# Altium project PCB_Project.PrjPcb
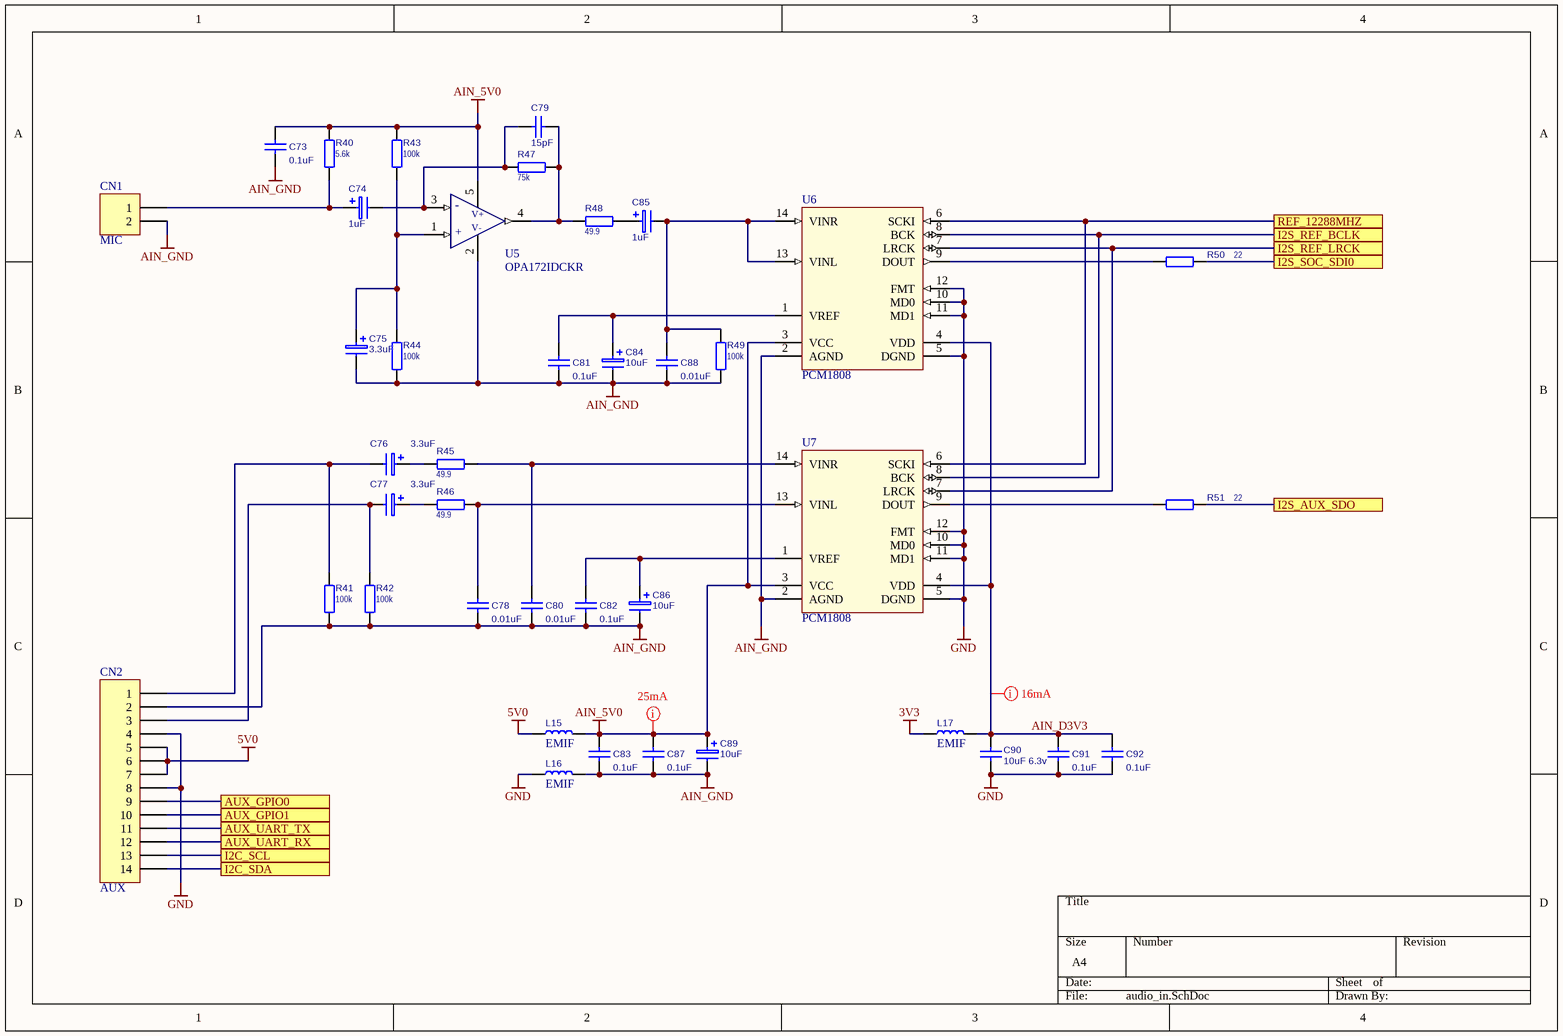
[diagram p0: audio_in.SchDoc]
5 sheets, 229 parts. Net scope: global (net labels, ports and power ports of the same name join across sheets).
Board file: PCB.PcbDoc
Sheets:
  audio_in.SchDoc
  audio_dsp.SchDoc
  audio_amp_hf.SchDoc
  audio_amp.SchDoc
  mcu.SchDoc

## Sheet audio_in.SchDoc
size A4

### Parts
C73  value 0.1uF  [C0603]  (hidden comment: CC0603KRX7R9BB104)
C74  1uF  [ALUM_4]
C75  3.3uF  [ALUM_3.3]
C76  value 3.3uF  [ALUM_3.3]  (hidden comment: UWT1V3R3MCL2B)
C77  value 3.3uF  [ALUM_3.3]  (hidden comment: UWT1V3R3MCL2B)
C78  value 0.01uF  [C0603]  (hidden comment: CL10B103KB8NNNC)
C79  value 15pF  [C0603]  (hidden comment: CC0603GRNPO9BN150)
C80  value 0.01uF  [C0603]  (hidden comment: CL10B103KB8NNNC)
C81  value 0.1uF  [C0603]  (hidden comment: CC0603KRX7R9BB104)
C82  value 0.1uF  [C0603]  (hidden comment: CC0603KRX7R9BB104)
C83  value 0.1uF  [C0603]  (hidden comment: CC0603KRX7R9BB104)
C84  value 10uF  [ALUM_4]  (hidden comment: CB016M0010RSB-0405)
C85  1uF  [ALUM_4]
C86  value 10uF  [ALUM_4]  (hidden comment: CB016M0010RSB-0405)
C87  value 0.1uF  [C0603]  (hidden comment: CC0603KRX7R9BB104)
C88  value 0.01uF  [C0603]  (hidden comment: CL10B103KB8NNNC)
C89  value 10uF  [ALUM_3.3]  (hidden comment: CB016M0010RSB-0405)
C90  value 10uF 6.3v  [C0603]  (hidden comment: CC0603MRX5R5BB106)
C91  value 0.1uF  [C0603]  (hidden comment: CC0603KRX7R9BB104)
C92  value 0.1uF  [C0603]  (hidden comment: CC0603KRX7R9BB104)
CN1  MIC  [DG308-2.54-2P]
CN2  AUX  [PLS-14R]
L15  value EMIF  [IND0603]  (hidden comment: BLM18AG102SN1D)
L16  value EMIF  [IND0603]  (hidden comment: BLM18AG102SN1D)
L17  value EMIF  [IND0603]  (hidden comment: BLM18AG102SN1D)
R40  5.6k  [R0603]
R41  100k  [R0603]
R42  100k  [R0603]
R43  100k  [R0603]
R44  100k  [R0603]
R45  49.9  [R0603]
R46  49.9  [R0603]
R47  75k  [R0603]
R48  49.9  [R0603]
R49  100k  [R0603]
R50  22  [R0603]
R51  22  [R0603]
U5  OPA172IDCKR  [SC70-5]
U6  PCM1808  [TSSOP-14]
U7  PCM1808  [TSSOP-14]

### Ports
AUX_GPIO0, AUX_GPIO1, AUX_UART_RX, AUX_UART_TX, I2C_SCL, I2C_SDA, I2S_AUX_SDO, I2S_REF_BCLK, I2S_REF_LRCK, I2S_SOC_SDI0, REF_12288MHZ

### Nets
3V3: L17.2
5V0: CN2.5 CN2.6 CN2.7 L15.2
AIN_5V0: C73.1 C83.1 C87.1 C89.1(+) L15.1 R40.1 R43.1 U5.5(V+) U6.3(VCC) U7.3(VCC)
AIN_GND: C73.2 C75.2(-) C78.2 C80.2 C81.2 C82.2 C83.2 C84.2(-) C86.2(-) C87.2 C88.2 C89.2(-) CN1.2 CN2.2 L16.1 R41.2 R42.2 R44.2 R49.2 U5.2(V-) U6.2(AGND) U7.2(AGND)
GND: C90.1 C91.2 C92.2 CN2.4 CN2.8 L16.2 U6.5(DGND) U6.10(MD0) U6.11(MD1) U6.12(FMT) U7.5(DGND) U7.10(MD0) U7.11(MD1) U7.12(FMT)
AIN_D3V3: C90.2 C91.1 C92.1 L17.1 U6.4(VDD) U7.4(VDD)
AUX_GPIO0: CN2.9 ; port AUX_GPIO0
AUX_GPIO1: CN2.10 ; port AUX_GPIO1
AUX_UART_RX: CN2.12 ; port AUX_UART_RX
AUX_UART_TX: CN2.11 ; port AUX_UART_TX
I2C_SCL: CN2.13 ; port I2C_SCL
I2C_SDA: CN2.14 ; port I2C_SDA
I2S_AUX_SDO: R51.2 ; port I2S_AUX_SDO
I2S_REF_BCLK: U6.8(BCK) U7.8(BCK) ; port I2S_REF_BCLK
I2S_REF_LRCK: U6.7(LRCK) U7.7(LRCK) ; port I2S_REF_LRCK
I2S_SOC_SDI0: R50.2 ; port I2S_SOC_SDI0
REF_12288MHZ: U6.6(SCKI) U7.6(SCKI) ; port REF_12288MHZ
NetC74_1: C74.1(+) CN1.1 R40.2
NetC74_2: C74.2(-) C79.1 R47.2 U5.3(-)
NetC75_1: C75.1(+) R43.2 R44.1 U5.1(+)
NetC76_1: C76.1(+) R45.1
NetC76_2: C76.2(-) CN2.1 R41.1
NetC77_1: C77.1(+) R46.1
NetC77_2: C77.2(-) CN2.3 R42.1
NetC78_1: C78.1 R46.2 U7.13(VINL)
NetC79_2: C79.2 R47.1 R48.1 U5.4
NetC80_1: C80.1 R45.2 U7.14(VINR)
NetC81_1: C81.1 C84.1(+) U6.1(VREF)
NetC82_1: C82.1 C86.1(+) U7.1(VREF)
NetC85_1: C85.1(+) R48.2
NetC85_2: C85.2(-) C88.1 R49.1 U6.13(VINL) U6.14(VINR)
NetR50_1: R50.1 U6.9(DOUT)
NetR51_1: R51.1 U7.9(DOUT)

### Layout directives
mark named 16mA: AIN_D3V3
mark named 25mA: AIN_5V0

### Library data of the parts
C73 C78-C83 C87 C88 C90-C92 = CAP_NPOL
C74-C77 C84-C86 C89 = CAP_POL
  C74 C85: Value: 1uF
  C75: Value: 3.3uF
CN1 = HDR 2: Header, 2-Pin; LatestRevisionDate: 17-Jul-2002; LatestRevisionNote: Re-released for DXP Platform.; Publisher: Altium Limited
CN2 = HDR 14: Header, 14-Pin; LatestRevisionDate: 17-Jul-2002; LatestRevisionNote: Re-released for DXP Platform.; Publisher: Altium Limited
L15-L17 = IND_WO_IRON
R40-R51 = RESISTOR: RES
  R40: Value: 5.6k
  R41-R44 R49: Value: 100k
  R45 R46 R48: Value: 49.9
  R47: Value: 75k
  R50 R51: Value: 22
U5 = OPA172IDCKR: OPAx172 36-V, Single-Supply, 10-MHz, Rail-to-Rail Output Operational Amplifiers; value: OPA172IDCKR
U6 U7 = PCM1808: PCM1808 Single-Ended, Analog-Input 24-Bit, 96-kHz Stereo ADC; value: PCM1808

## Sheet audio_dsp.SchDoc
size A4
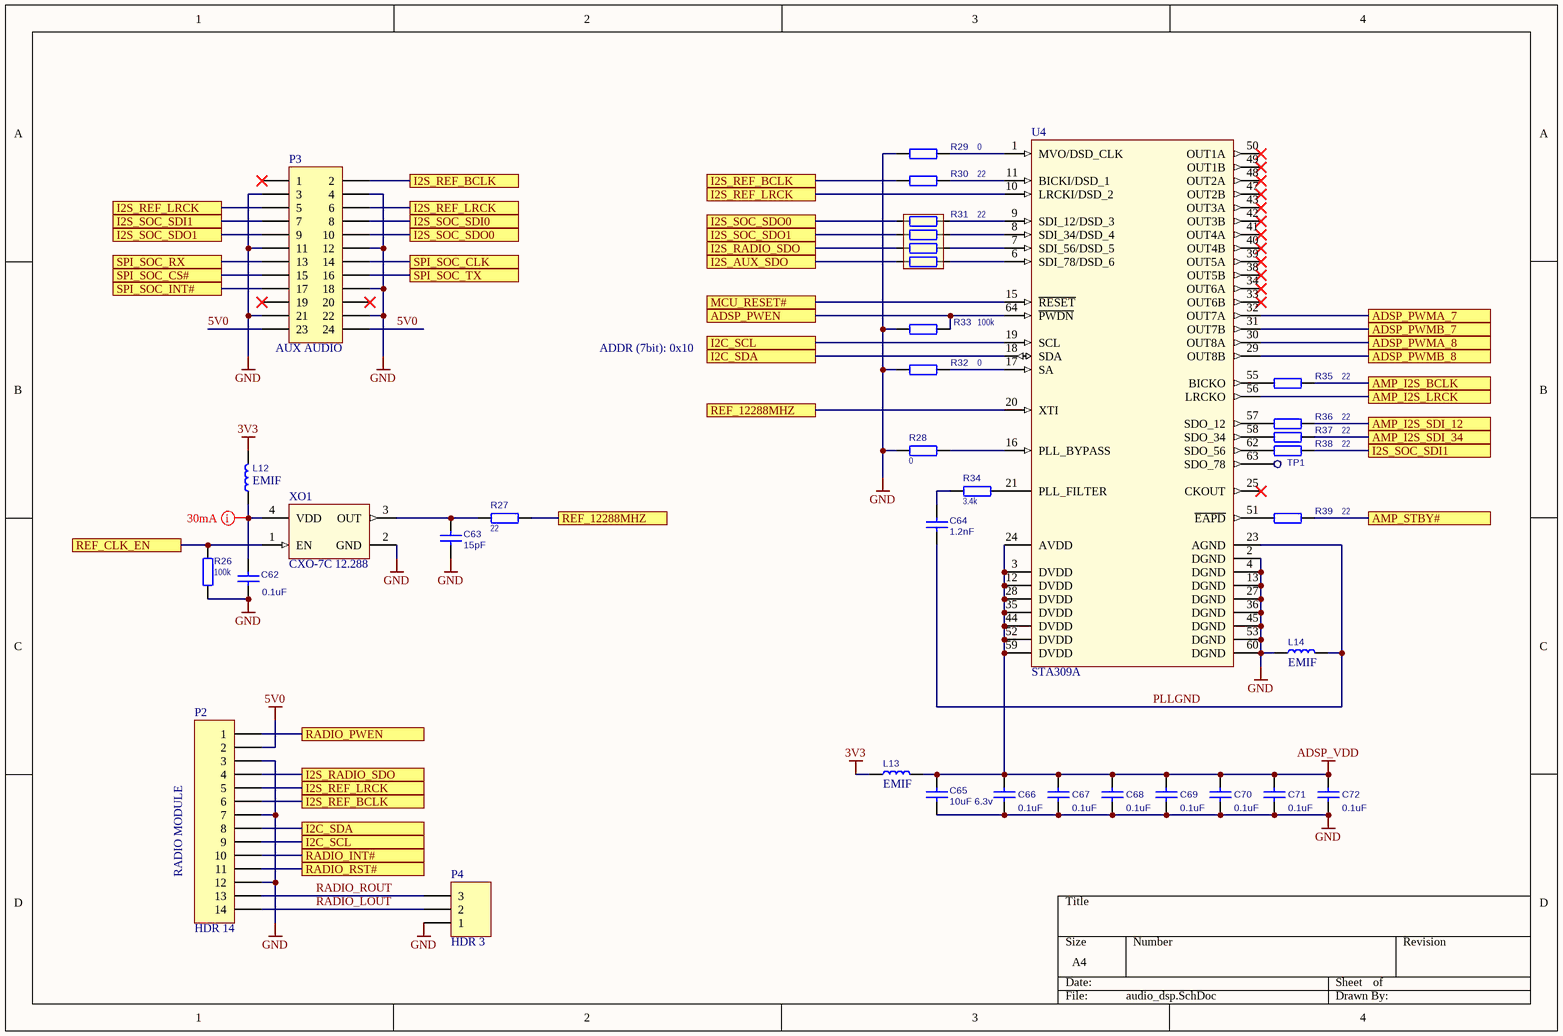
[diagram p1: audio_dsp.SchDoc]

### Parts
C62  value 0.1uF  [C0603]  (hidden comment: CC0603KRX7R9BB104)
C63  value 15pF  [C0603]  (hidden comment: CC0603GRNPO9BN150)
C64  value 1.2nF  [C0603]  (hidden comment: GRM1885C1H122JA01D)
C65  value 10uF 6.3v  [C0603]  (hidden comment: CC0603MRX5R5BB106)
C66  value 0.1uF  [C0603]  (hidden comment: CC0603KRX7R9BB104)
C67  value 0.1uF  [C0603]  (hidden comment: CC0603KRX7R9BB104)
C68  value 0.1uF  [C0603]  (hidden comment: CC0603KRX7R9BB104)
C69  value 0.1uF  [C0603]  (hidden comment: CC0603KRX7R9BB104)
C70  value 0.1uF  [C0603]  (hidden comment: CC0603KRX7R9BB104)
C71  value 0.1uF  [C0603]  (hidden comment: CC0603KRX7R9BB104)
C72  value 0.1uF  [C0603]  (hidden comment: CC0603KRX7R9BB104)
L12  value EMIF  [IND0603]  (hidden comment: BLM18AG102SN1D)
L13  value EMIF  [IND0603]  (hidden comment: BLM18AG102SN1D)
L14  value EMIF  [IND0603]  (hidden comment: BLM18AG102SN1D)
P2  HDR 14  [PLS-14]
P3  AUX AUDIO  [PLD-12]
P4  HDR 3  [PLS-3]
R26  value 100k  [R0603]  (hidden comment: 47k)
R27  22  [R0603]
R28  0  [R0603]
R29  0  [R0603]
R30  22  [R0603]
R31  value 22  [R0804X4]  (hidden comment: TC124-JR-0722RL)
R32  0  [R0603]
R33  100k  [R0603]
R34  3.4k  [R0603]
R35  22  [R0603]
R36  22  [R0603]
R37  22  [R0603]
R38  22  [R0603]
R39  22  [R0603]
TP1  TEST-POINT  [PAD]  (value not drawn)
U4  STA309A  [PM064_N]
XO1  CXO-7C 12.288  [CXO-5032]

### Ports
ADSP_PWEN, ADSP_PWMA_7, ADSP_PWMA_8, ADSP_PWMB_7, ADSP_PWMB_8, AMP_I2S_BCLK, AMP_I2S_LRCK, AMP_I2S_SDI_12, AMP_I2S_SDI_34, AMP_STBY#, I2C_SCL, I2C_SDA, I2S_AUX_SDO, I2S_RADIO_SDO, I2S_REF_BCLK, I2S_REF_LRCK, I2S_SOC_SDI0, I2S_SOC_SDI1, I2S_SOC_SDO0, I2S_SOC_SDO1, MCU_RESET#, RADIO_INT#, RADIO_PWEN, RADIO_RST#, REF_12288MHZ, REF_CLK_EN, SPI_SOC_CLK, SPI_SOC_CS#, SPI_SOC_INT#, SPI_SOC_RX, SPI_SOC_TX

### Nets
3V3: L12.1 L13.2
5V0: P2.2 P3.23 P3.24
ADSP_VDD: C65.2 C66.1 C67.1 C68.1 C69.1 C70.1 C71.1 C72.1 L13.1 U4.3(DVDD) U4.12(DVDD) U4.24(AVDD) U4.28(DVDD) U4.35(DVDD) U4.44(DVDD) U4.52(DVDD) U4.59(DVDD)
GND: C62.1 C63.2 C65.1 C66.2 C67.2 C68.2 C69.2 C70.2 C71.2 C72.2 L14.2 P2.3 P2.7 P2.12 P3.3 P3.4 P3.11 P3.12 P3.18 P3.21 P3.22 P4.1 R26.2 R28.1 R29.1 R32.1 R33.2 U4.2(DGND) U4.4(DGND) U4.13(DGND) U4.27(DGND) U4.36(DGND) U4.45(DGND) U4.53(DGND) U4.60(DGND) XO1.2(GND)
ADSP_PWEN: R33.1 U4.64(~{PWDN}) ; port ADSP_PWEN
ADSP_PWMA_7: U4.32(OUT7A) ; port ADSP_PWMA_7
ADSP_PWMA_8: U4.30(OUT8A) ; port ADSP_PWMA_8
ADSP_PWMB_7: U4.31(OUT7B) ; port ADSP_PWMB_7
ADSP_PWMB_8: U4.29(OUT8B) ; port ADSP_PWMB_8
AMP_I2S_BCLK: R35.2 ; port AMP_I2S_BCLK
AMP_I2S_LRCK: U4.56(LRCKO) ; port AMP_I2S_LRCK
AMP_I2S_SDI_12: R36.2 ; port AMP_I2S_SDI_12
AMP_I2S_SDI_34: R37.2 ; port AMP_I2S_SDI_34
AMP_STBY#: R39.2 ; port AMP_STBY#
I2C_SCL: P2.9 U4.19(SCL) ; port I2C_SCL
I2C_SDA: P2.8 U4.18(SDA) ; port I2C_SDA
I2S_AUX_SDO: R31.1 ; port I2S_AUX_SDO
I2S_RADIO_SDO: P2.4 R31.3 ; port I2S_RADIO_SDO
I2S_REF_BCLK: P2.6 P3.2 R30.1 ; port I2S_REF_BCLK
I2S_REF_LRCK: P2.5 P3.5 P3.6 U4.10(LRCKI/DSD_2) ; port I2S_REF_LRCK
I2S_SOC_SDI0: P3.8 ; port I2S_SOC_SDI0
I2S_SOC_SDI1: P3.7 R38.2 ; port I2S_SOC_SDI1
I2S_SOC_SDO0: P3.10 R31.7 ; port I2S_SOC_SDO0
I2S_SOC_SDO1: P3.9 R31.5 ; port I2S_SOC_SDO1
MCU_RESET#: U4.15(~{RESET}) ; port MCU_RESET#
PLLGND: C64.2 L14.1 U4.23(AGND)
RADIO_INT#: P2.10 ; port RADIO_INT#
RADIO_LOUT: P2.14 P4.2
RADIO_PWEN: P2.1 ; port RADIO_PWEN
RADIO_ROUT: P2.13 P4.3
RADIO_RST#: P2.11 ; port RADIO_RST#
REF_12288MHZ: R27.1 U4.20(XTI) ; port REF_12288MHZ
REF_CLK_EN: R26.1 XO1.1(EN) ; port REF_CLK_EN
SPI_SOC_CLK: P3.14 ; port SPI_SOC_CLK
SPI_SOC_CS#: P3.15 ; port SPI_SOC_CS#
SPI_SOC_INT#: P3.17 ; port SPI_SOC_INT#
SPI_SOC_RX: P3.13 ; port SPI_SOC_RX
SPI_SOC_TX: P3.16 ; port SPI_SOC_TX
NetC62_2: C62.2 L12.2 XO1.4(VDD)
NetC63_1: C63.1 R27.2 XO1.3(OUT)
NetC64_1: C64.1 R34.2
NetR28_2: R28.2 U4.16(PLL_BYPASS)
NetR29_2: R29.2 U4.1(MVO/DSD_CLK)
NetR30_2: R30.2 U4.11(BICKI/DSD_1)
NetR31_2: R31.2 U4.6(SDI_78/DSD_6)
NetR31_4: R31.4 U4.7(SDI_56/DSD_5)
NetR31_6: R31.6 U4.8(SDI_34/DSD_4)
NetR31_8: R31.8 U4.9(SDI_12/DSD_3)
NetR32_2: R32.2 U4.17(SA)
NetR34_1: R34.1 U4.21(PLL_FILTER)
NetR35_1: R35.1 U4.55(BICKO)
NetR36_1: R36.1 U4.57(SDO_12)
NetR37_1: R37.1 U4.58(SDO_34)
NetR38_1: R38.1 U4.62(SDO_56)
NetR39_1: R39.1 U4.51(~{EAPD})
NetTP1_1: TP1.1 U4.63(SDO_78)

Not connected (* = marked no-connect by the designer): P3 1* 19* 20*; U4 25(CKOUT)* 33(OUT6B)* 34(OUT6A)* 38(OUT5B)* 39(OUT5A)* 40(OUT4B)* 41(OUT4A)* 42(OUT3B)* 43(OUT3A)* 47(OUT2B)* 48(OUT2A)* 49(OUT1B)* 50(OUT1A)*

### Layout directives
mark named 30mA: NetC62_2

### Notes on the sheet
- ADDR (7bit): 0x10
- (near P2) RADIO MODULE

### Library data of the parts
C62-C72 = CAP_NPOL
L12-L14 = IND_WO_IRON
P2 = HDR 14: Header, 14-Pin; LatestRevisionDate: 17-Jul-2002; LatestRevisionNote: Re-released for DXP Platform.; Publisher: Altium Limited
P3 = HDR 12X2: Header, 12-Pin, Dual row; LatestRevisionDate: 17-Jul-2002; LatestRevisionNote: Re-released for DXP Platform.; Publisher: Altium Limited
P4 = HDR 3: Header, 3-Pin; LatestRevisionDate: 17-Jul-2002; LatestRevisionNote: Re-released for DXP Platform.; Publisher: Altium Limited
R26-R30 R32-R39 = RESISTOR: RES
  R27 R30 R35-R39: Value: 22
  R28 R29 R32: Value: 0
  R33: Value: 100k
  R34: Value: 3.4k
R31 = ARRAY
TP1 = TEST-POINT: PCB terminal block; Value: *
U4 = STA309A: Multi-channel digital audio processor with DDX®; Value: STA309A
XO1 = CXO-7C: value: CXO-7C

## Sheet audio_amp_hf.SchDoc
size A4
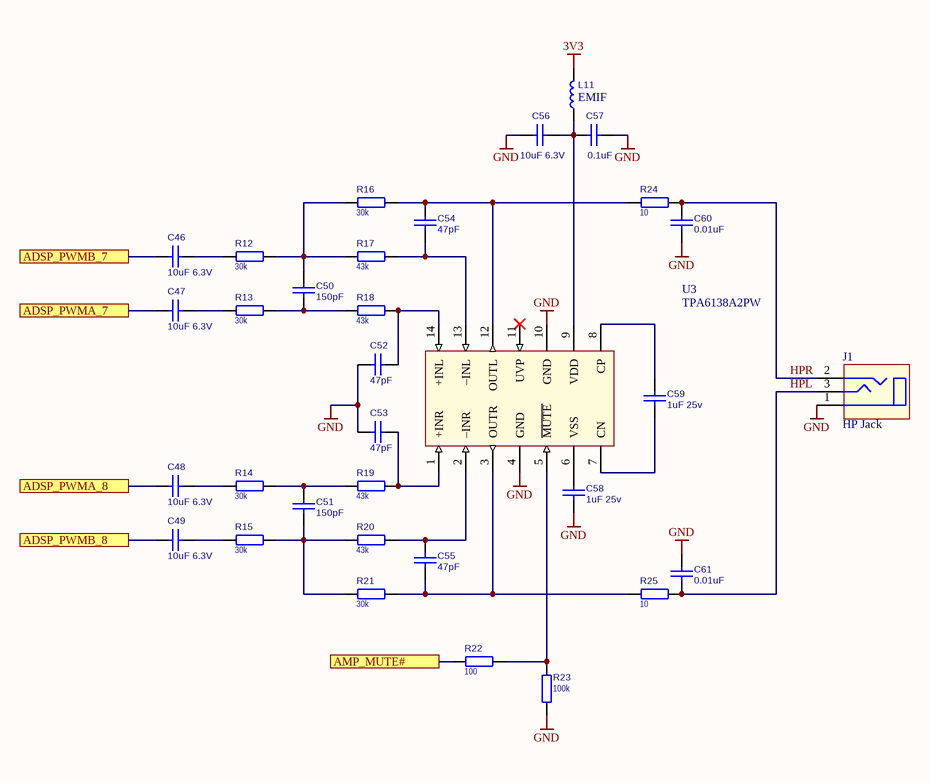
[diagram p2: audio_amp_hf.SchDoc]

### Parts
C46  value 10uF 6.3V  [C0603]  (hidden comment: CC0603MRX5R5BB106)
C47  value 10uF 6.3V  [C0603]  (hidden comment: CC0603MRX5R5BB106)
C48  value 10uF 6.3V  [C0603]  (hidden comment: CC0603MRX5R5BB106)
C49  value 10uF 6.3V  [C0603]  (hidden comment: CC0603MRX5R5BB106)
C50  value 150pF  [C0603]  (hidden comment: CC0603JRNPO9BN151)
C51  value 150pF  [C0603]  (hidden comment: CC0603JRNPO9BN151)
C52  value 47pF  [C0603]  (hidden comment: CC0603JRNPO9BN470)
C53  value 47pF  [C0603]  (hidden comment: CC0603JRNPO9BN470)
C54  value 47pF  [C0603]  (hidden comment: CC0603JRNPO9BN470)
C55  value 47pF  [C0603]  (hidden comment: CC0603JRNPO9BN470)
C56  value 10uF 6.3V  [C0603]  (hidden comment: CC0603MRX5R5BB106)
C57  value 0.1uF  [C0603]  (hidden comment: C1608X7R1H104K080AA)
C58  value 1uF 25v  [C0603]  (hidden comment: GRM188R61E105KA12D)
C59  value 1uF 25v  [C0603]  (hidden comment: GRM188R61E105KA12D)
C60  value 0.01uF  [C0603]  (hidden comment: CL10B103KB8NNNC)
C61  value 0.01uF  [C0603]  (hidden comment: CL10B103KB8NNNC)
J1  value HP Jack  [AUB-13]  (hidden comment: AUB-13)
L11  value EMIF  [IND0603]  (hidden comment: BLM18AG102SN1D)
R12  30k  [R0603]
R13  30k  [R0603]
R14  30k  [R0603]
R15  30k  [R0603]
R16  30k  [R0603]
R17  43k  [R0603]
R18  43k  [R0603]
R19  43k  [R0603]
R20  43k  [R0603]
R21  30k  [R0603]
R22  100  [R0603]
R23  100k  [R0603]
R24  10  [R0805]
R25  10  [R0805]
U3  TPA6138A2PW  [TSSOP-14]

### Ports
ADSP_PWMA_7, ADSP_PWMA_8, ADSP_PWMB_7, ADSP_PWMB_8, AMP_MUTE#

### Nets
3V3: L11.2
GND: C52.2 C53.2 C56.2 C57.1 C58.1 C60.1 C61.2 J1.1(C) R23.2 U3.4(GND) U3.10(GND)
ADSP_PWMA_7: C47.2 ; port ADSP_PWMA_7
ADSP_PWMA_8: C48.2 ; port ADSP_PWMA_8
ADSP_PWMB_7: C46.2 ; port ADSP_PWMB_7
ADSP_PWMB_8: C49.2 ; port ADSP_PWMB_8
AMP_MUTE#: R22.1 ; port AMP_MUTE#
HPL: C61.1 J1.3(L) R25.1
HPR: C60.2 J1.2(R) R24.1
NetC46_1: C46.1 R12.2
NetC47_1: C47.1 R13.2
NetC48_1: C48.1 R14.2
NetC49_1: C49.1 R15.2
NetC50_1: C50.1 R13.1 R18.2
NetC50_2: C50.2 R12.1 R16.2 R17.2
NetC51_1: C51.1 R15.1 R20.2 R21.2
NetC51_2: C51.2 R14.1 R19.2
NetC52_1: C52.1 R18.1 U3.14(+INL)
NetC53_1: C53.1 R19.1 U3.1(+INR)
NetC54_1: C54.1 R17.1 U3.13(–INL)
NetC54_2: C54.2 R16.1 R24.2 U3.12(OUTL)
NetC55_1: C55.1 R21.1 R25.2 U3.3(OUTR)
NetC55_2: C55.2 R20.1 U3.2(–INR)
NetC56_1: C56.1 C57.2 L11.1 U3.9(VDD)
NetC58_2: C58.2 U3.6(VSS)
NetC59_1: C59.1 U3.7(CN)
NetC59_2: C59.2 U3.8(CP)
NetR22_2: R22.2 R23.1 U3.5(~{MUTE})

Not connected (* = marked no-connect by the designer): U3 11(UVP)*

### Library data of the parts
C46-C61 = CAP_NPOL
J1 = PhoneJack: Phonejack Stereo
L11 = IND_WO_IRON
R12-R25 = RESISTOR: RES
  R12-R16 R21: Value: 30k
  R17-R20: Value: 43k
  R22: Value: 100
  R23: Value: 100k
  R24 R25: Value: 10
U3 = TPA6138A2: DirectPath™ Headphone Driver With Adjustable Gain; value: TPA6138A2PW

## Sheet audio_amp.SchDoc
size A4
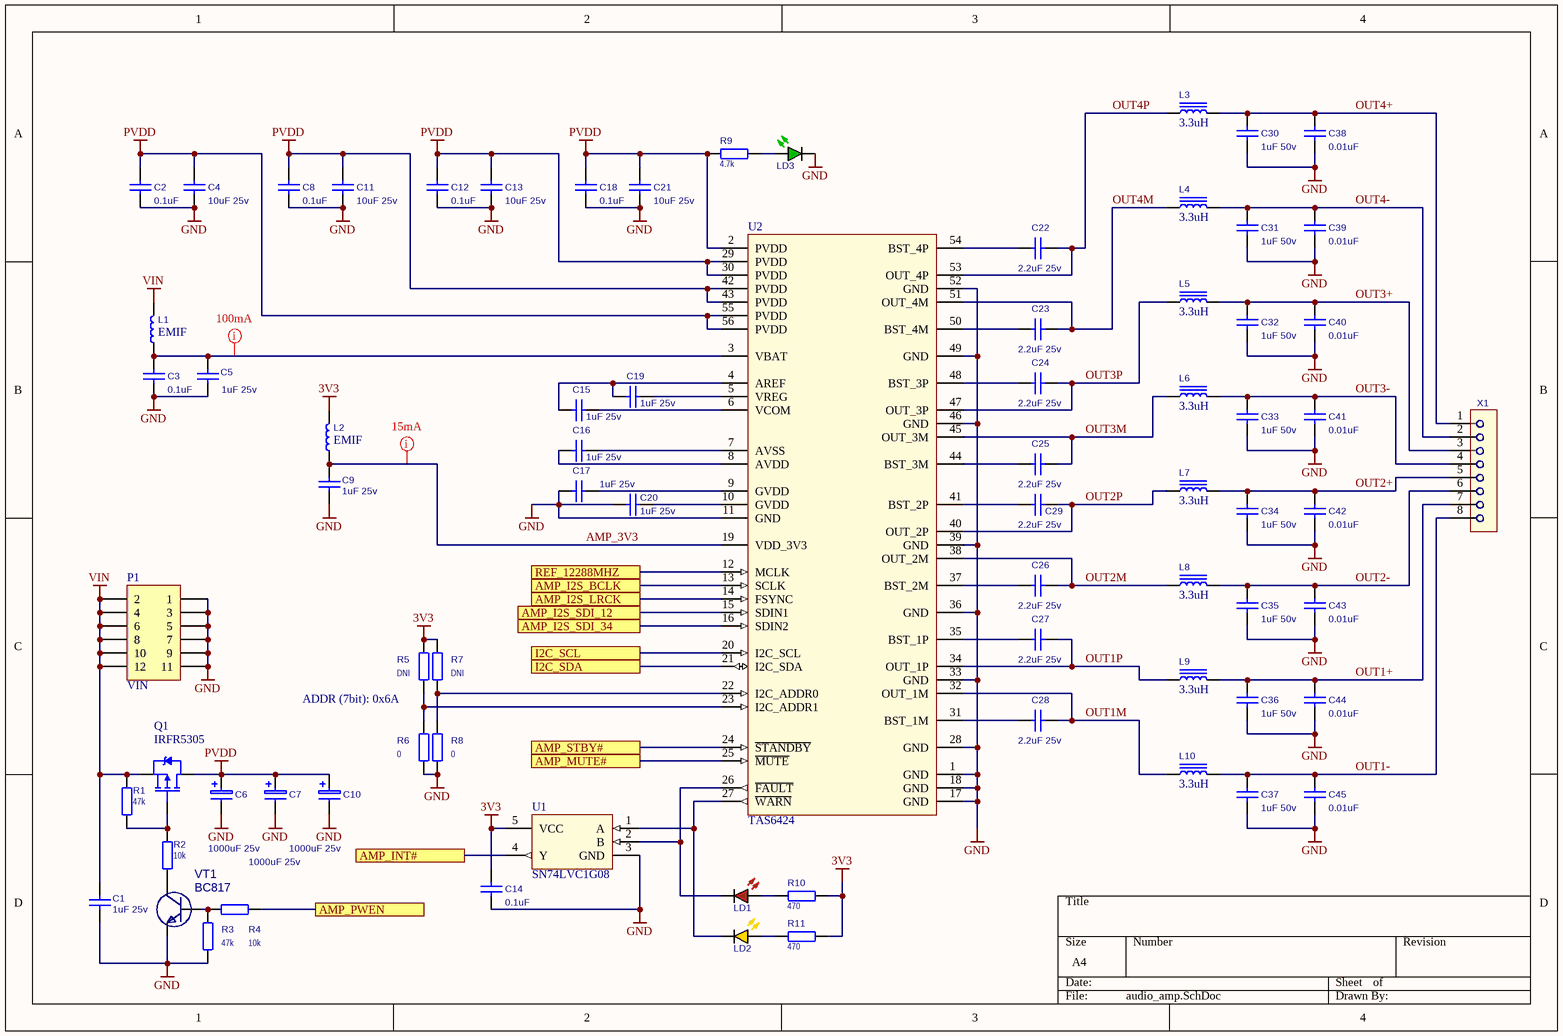
[diagram p3: audio_amp.SchDoc]

### Parts
C1  value 1uF 25v  [C0603]  (hidden comment: GRM188R61E105KA12D)
C2  value 0.1uF  [C0603]  (hidden comment: CC0603KRX7R9BB104)
C3  value 0.1uF  [C0603]  (hidden comment: CC0603KRX7R9BB104)
C4  value 10uF 25v  [C0805]  (hidden comment: GRM21BR61E106KA73L)
C5  value 1uF 25v  [C0603]  (hidden comment: GRM188R61E105KA12D)
C6  value 1000uF 25v  [R12H05]  (hidden comment: EEUFM1E102)
C7  value 1000uF 25v  [R12H05]  (hidden comment: EEUFM1E102)
C8  value 0.1uF  [C0603]  (hidden comment: CC0603KRX7R9BB104)
C9  value 1uF 25v  [C0603]  (hidden comment: GRM188R61E105KA12D)
C10  value 1000uF 25v  [R12H05]  (hidden comment: EEUFM1E102)
C11  value 10uF 25v  [C0805]  (hidden comment: GRM21BR61E106KA73L)
C12  value 0.1uF  [C0603]  (hidden comment: CC0603KRX7R9BB104)
C13  value 10uF 25v  [C0805]  (hidden comment: GRM21BR61E106KA73L)
C14  value 0.1uF  [C0603]  (hidden comment: CC0603KRX7R9BB104)
C15  value 1uF 25v  [C0603]  (hidden comment: GRM188R61E105KA12D)
C16  value 1uF 25v  [C0603]  (hidden comment: GRM188R61E105KA12D)
C17  value 1uF 25v  [C0603]  (hidden comment: GRM188R61E105KA12D)
C18  value 0.1uF  [C0603]  (hidden comment: CC0603KRX7R9BB104)
C19  value 1uF 25v  [C0603]  (hidden comment: GRM188R61E105KA12D)
C20  value 1uF 25v  [C0603]  (hidden comment: GRM188R61E105KA12D)
C21  value 10uF 25v  [C0805]  (hidden comment: GRM21BR61E106KA73L)
C22  value 2.2uF 25v  [C0603]  (hidden comment: CL10A225KA8NNNC)
C23  value 2.2uF 25v  [C0603]  (hidden comment: CL10A225KA8NNNC)
C24  value 2.2uF 25v  [C0603]  (hidden comment: CL10A225KA8NNNC)
C25  value 2.2uF 25v  [C0603]  (hidden comment: CL10A225KA8NNNC)
C26  value 2.2uF 25v  [C0603]  (hidden comment: CL10A225KA8NNNC)
C27  value 2.2uF 25v  [C0603]  (hidden comment: CL10A225KA8NNNC)
C28  value 2.2uF 25v  [C0603]  (hidden comment: CL10A225KA8NNNC)
C29  value 2.2uF 25v  [C0603]  (hidden comment: CL10A225KA8NNNC)
C30  value 1uF 50v  [C0603]  (hidden comment: CL10A105KB8NNNC)
C31  value 1uF 50v  [C0603]  (hidden comment: CL10A105KB8NNNC)
C32  value 1uF 50v  [C0603]  (hidden comment: CL10A105KB8NNNC)
C33  value 1uF 50v  [C0603]  (hidden comment: CL10A105KB8NNNC)
C34  value 1uF 50v  [C0603]  (hidden comment: CL10A105KB8NNNC)
C35  value 1uF 50v  [C0603]  (hidden comment: CL10A105KB8NNNC)
C36  value 1uF 50v  [C0603]  (hidden comment: CL10A105KB8NNNC)
C37  value 1uF 50v  [C0603]  (hidden comment: CL10A105KB8NNNC)
C38  value 0.01uF  [C0603]  (hidden comment: CL10B103KB8NNNC)
C39  value 0.01uF  [C0603]  (hidden comment: CL10B103KB8NNNC)
C40  value 0.01uF  [C0603]  (hidden comment: CL10B103KB8NNNC)
C41  value 0.01uF  [C0603]  (hidden comment: CL10B103KB8NNNC)
C42  value 0.01uF  [C0603]  (hidden comment: CL10B103KB8NNNC)
C43  value 0.01uF  [C0603]  (hidden comment: CL10B103KB8NNNC)
C44  value 0.01uF  [C0603]  (hidden comment: CL10B103KB8NNNC)
C45  value 0.01uF  [C0603]  (hidden comment: CL10B103KB8NNNC)
L1  value EMIF  [IND0603]  (hidden comment: BLM18AG102SN1D)
L2  value EMIF  [IND0603]  (hidden comment: BLM18AG102SN1D)
L3  value 3.3uH  [IHLP-2525CZ]  (hidden comment: IHLP2525CZER3R3M01)
L4  value 3.3uH  [IHLP-2525CZ]  (hidden comment: IHLP2525CZER3R3M01)
L5  value 3.3uH  [IHLP-2525CZ]  (hidden comment: IHLP2525CZER3R3M01)
L6  value 3.3uH  [IHLP-2525CZ]  (hidden comment: IHLP2525CZER3R3M01)
L7  value 3.3uH  [IHLP-2525CZ]  (hidden comment: IHLP2525CZER3R3M01)
L8  value 3.3uH  [IHLP-2525CZ]  (hidden comment: IHLP2525CZER3R3M01)
L9  value 3.3uH  [IHLP-2525CZ]  (hidden comment: IHLP2525CZER3R3M01)
L10  value 3.3uH  [IHLP-2525CZ]  (hidden comment: IHLP2525CZER3R3M01)
LD1  LED_R  [R0603]  (value not drawn)
LD2  LED_Y  [R0603]  (value not drawn)
LD3  LED_G  [R0603]  (value not drawn)
P1  VIN  [PLD-6]
Q1  IRFR5305  [D-PAK]
R1  47k  [R0603]
R2  10k  [R0603]
R3  47k  [R0603]
R4  10k  [R0603]
R5  value DNI  [R0603]  (hidden comment: 47k)
R6  value 0  [R0603]  (hidden comment: 47k)
R7  value DNI  [R0603]  (hidden comment: 47k)
R8  value 0  [R0603]  (hidden comment: 47k)
R9  4.7k  [R0603]
R10  470  [R0603]
R11  470  [R0603]
U1  value SN74LVC1G08  [SOT-23-5]  (hidden comment: SN74LVC1G08DBVR)
U2  TAS6424  [HSSOP-56]
VT1  BC817  [SOT-23-3]
X1  DGxxx-8  [DG126-5.0-8P]  (value not drawn)

### Ports
AMP_I2S_BCLK, AMP_I2S_LRCK, AMP_I2S_SDI_12, AMP_I2S_SDI_34, AMP_INT#, AMP_MUTE#, AMP_PWEN, AMP_STBY#, I2C_SCL, I2C_SDA, REF_12288MHZ

### Nets
3V3: C14.1 L2.2 R5.1 R7.1 R10.1 R11.1 U1.5(VCC)
GND: C1.1 C2.2 C3.2 C4.2 C5.1 C6.2(-) C7.2(-) C8.2 C9.1 C10.2(-) C11.2 C12.2 C13.2 C14.2 C17.1 C18.2 C20.1 C21.2 C30.2 C31.2 C32.2 C33.2 C34.2 C35.2 C36.2 C37.2 C38.2 C39.2 C40.2 C41.2 C42.2 C43.2 C44.2 C45.2 LD3.1 P1.1 P1.3 P1.5 P1.7 P1.9 P1.11 R3.1 R6.2 R8.2 U1.3(GND) U2.1(GND) U2.11(GND) U2.17(GND) U2.18(GND) U2.28(GND) U2.33(GND) U2.36(GND) U2.39(GND) U2.46(GND) U2.49(GND) U2.52(GND) VT1.2
PVDD: C2.1 C4.1 C6.1(+) C7.1(+) C8.1 C10.1(+) C11.1 C12.1 C13.1 C18.1 C21.1 Q1.2(D) R9.1 U2.2(PVDD) U2.29(PVDD) U2.30(PVDD) U2.42(PVDD) U2.43(PVDD) U2.55(PVDD) U2.56(PVDD)
VIN: C1.2 L1.2 P1.2 P1.4 P1.6 P1.8 P1.10 P1.12 Q1.3(S) R1.1
AMP_3V3: C9.2 L2.1 U2.19(VDD_3V3)
AMP_I2S_BCLK: U2.13(SCLK) ; port AMP_I2S_BCLK
AMP_I2S_LRCK: U2.14(FSYNC) ; port AMP_I2S_LRCK
AMP_I2S_SDI_12: U2.15(SDIN1) ; port AMP_I2S_SDI_12
AMP_I2S_SDI_34: U2.16(SDIN2) ; port AMP_I2S_SDI_34
AMP_INT#: U1.4(Y) ; port AMP_INT#
AMP_MUTE#: U2.25(~{MUTE}) ; port AMP_MUTE#
AMP_PWEN: R4.1 ; port AMP_PWEN
AMP_STBY#: U2.24(~{STANDBY}) ; port AMP_STBY#
I2C_SCL: U2.20(I2C_SCL) ; port I2C_SCL
I2C_SDA: U2.21(I2C_SDA) ; port I2C_SDA
OUT1+: C36.1 C44.1 L9.2 X1.7
OUT1-: C37.1 C45.1 L10.2 X1.8
OUT1M: C28.1 L10.1 U2.32(OUT_1M)
OUT1P: C27.1 L9.1 U2.34(OUT_1P)
OUT2+: C34.1 C42.1 L7.2 X1.5
OUT2-: C35.1 C43.1 L8.2 X1.6
OUT2M: C26.1 L8.1 U2.38(OUT_2M)
OUT2P: C29.1 L7.1 U2.40(OUT_2P)
OUT3+: C32.1 C40.1 L5.2 X1.3
OUT3-: C33.1 C41.1 L6.2 X1.4
OUT3M: C25.1 L6.1 U2.45(OUT_3M)
OUT3P: C24.1 L5.1 U2.47(OUT_3P)
OUT4+: C30.1 C38.1 L3.2 X1.1
OUT4-: C31.1 C39.1 L4.1 X1.2
OUT4M: C23.1 L4.2 U2.51(OUT_4M)
OUT4P: C22.1 L3.1 U2.53(OUT_4P)
REF_12288MHZ: U2.12(MCLK) ; port REF_12288MHZ
NetC3_1: C3.1 C5.2 L1.1 U2.3(VBAT)
NetC15_1: C15.1 U2.6(VCOM)
NetC15_2: C15.2 C19.2 U2.4(AREF)
NetC16_1: C16.1 U2.8(AVDD)
NetC16_2: C16.2 U2.7(AVSS)
NetC17_2: C17.2 U2.9(GVDD)
NetC19_1: C19.1 U2.5(VREG)
NetC20_2: C20.2 U2.10(GVDD)
NetC22_2: C22.2 U2.54(BST_4P)
NetC23_2: C23.2 U2.50(BST_4M)
NetC24_2: C24.2 U2.48(BST_3P)
NetC25_2: C25.2 U2.44(BST_3M)
NetC26_2: C26.2 U2.37(BST_2M)
NetC27_2: C27.2 U2.35(BST_1P)
NetC28_2: C28.2 U2.31(BST_1M)
NetC29_2: C29.2 U2.41(BST_2P)
NetLD1_1: LD1.1 U1.2(B) U2.26(~{FAULT})
NetLD1_2: LD1.2 R10.2
NetLD2_1: LD2.1 U1.1(A) U2.27(~{WARN})
NetLD2_2: LD2.2 R11.2
NetLD3_2: LD3.2 R9.2
NetQ1_1: Q1.1(G) R1.2 R2.2
NetR2_1: R2.1 VT1.3
NetR3_2: R3.2 R4.2 VT1.1
NetR5_2: R5.2 R6.1 U2.23(I2C_ADDR1)
NetR7_2: R7.2 R8.1 U2.22(I2C_ADDR0)

### Layout directives
mark named 15mA: AMP_3V3
mark named 100mA: NetC3_1

### Notes on the sheet
- ADDR (7bit): 0x6A

### Library data of the parts
C1-C5 C8 C9 C11-C45 = CAP_NPOL
C6 C7 C10 = CAP_POL
L1 L2 = IND_WO_IRON
L3-L10 = IND_W_IRON
LD1 = LED_RED: LED Red; Value: *
LD2 = LED_YELLOW: LED Yellow; Value: *
LD3 = LED_GREEN: LED Green; Value: *
P1 = HDR 6X2: Header, 6-Pin, Dual row; LatestRevisionDate: 17-Jul-2002; LatestRevisionNote: Re-released for DXP Platform.; Publisher: Altium Limited
Q1 = P-Channel: HEXFET Power MOSFET
R1-R11 = RESISTOR: RES
  R1 R3: Value: 47k
  R2 R4: Value: 10k
  R9: Value: 4.7k
  R10 R11: Value: 470
U1 = SN74LVC1G08
U2 = TAS6424: 75-W, 2-MHz Digital Input 4-Channel Automotive Class-D Audio Amplifier  With Load-Dump Protection and I  2C Diagnostics; value: TAS6424
VT1 = N-P-N: Bipolar transistor N-P-N; Value: BC817
X1 = DGxxx-8: PCB terminal block; Value: *

## Sheet mcu.SchDoc
size A4
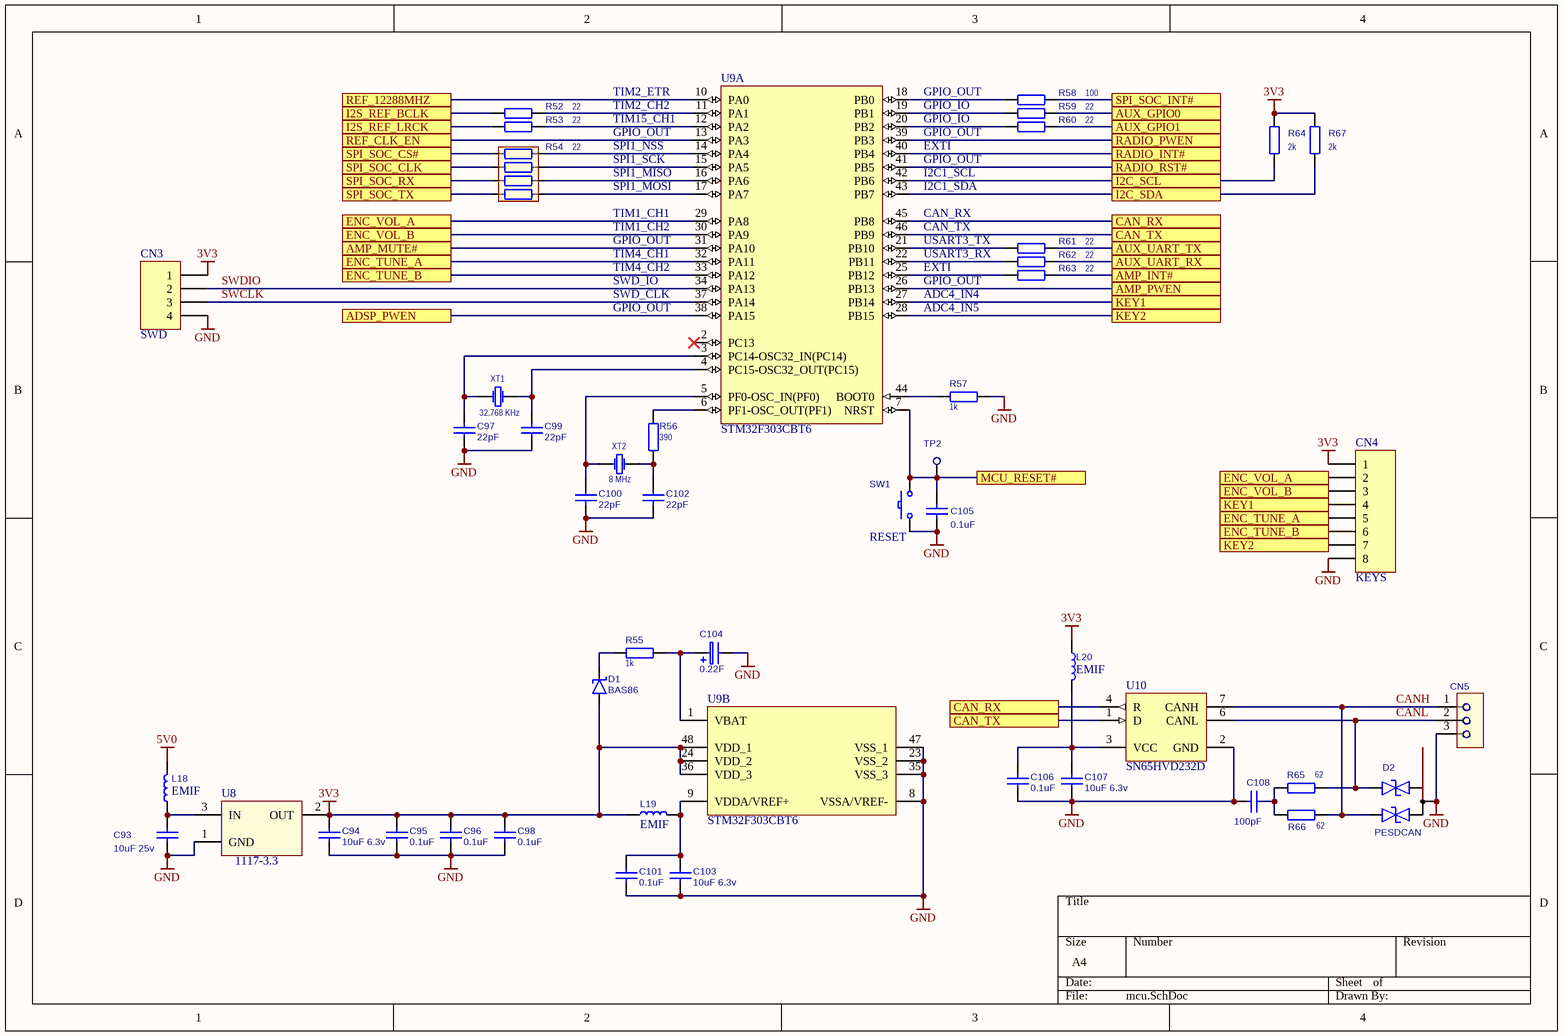
[diagram p4: mcu.SchDoc]

### Parts
C93  value 10uF 25v  [C0805]  (hidden comment: GRM21BR61E106KA73L)
C94  value 10uF 6.3v  [C0603]  (hidden comment: CC0603MRX5R5BB106)
C95  value 0.1uF  [C0603]  (hidden comment: CC0603KRX7R9BB104)
C96  value 0.1uF  [C0603]  (hidden comment: CC0603KRX7R9BB104)
C97  value 22pF  [C0603]  (hidden comment: CL10C220JB8NNNC)
C98  value 0.1uF  [C0603]  (hidden comment: CC0603KRX7R9BB104)
C99  value 22pF  [C0603]  (hidden comment: CL10C220JB8NNNC)
C100  value 22pF  [C0603]  (hidden comment: CL10C220JB8NNNC)
C101  value 0.1uF  [C0603]  (hidden comment: CC0603KRX7R9BB104)
C102  value 22pF  [C0603]  (hidden comment: CL10C220JB8NNNC)
C103  value 10uF 6.3v  [C0603]  (hidden comment: CC0603MRX5R5BB106)
C104  value 0.22F  [DS/DSK]  (hidden comment: CAP_POL)
C105  value 0.1uF  [C0603]  (hidden comment: C1608X7R1H104K080AA)
C106  value 0.1uF  [C0603]  (hidden comment: CC0603KRX7R9BB104)
C107  value 10uF 6.3v  [C0603]  (hidden comment: CC0603MRX5R5BB106)
C108  value 100pF  [C0603]  (hidden comment: CC0603JRNPO9BN101)
CN3  SWD  [PLS-4]
CN4  KEYS  [1.25-8AW]
CN5  DGxxx-3  [DG308-2.54-3P]  (value not drawn)
D1  value BAS86  [SOD-80C]  (hidden comment: SHOTTKY)
D2  value PESDCAN  [SOT-23-3]  (hidden comment: PESD)
L18  value EMIF  [IND0603]  (hidden comment: BLM18AG102SN1D)
L19  value EMIF  [IND0603]  (hidden comment: BLM18AG102SN1D)
L20  value EMIF  [IND0603]  (hidden comment: BLM18AG102SN1D)
R52  22  [R0603]
R53  22  [R0603]
R54  value 22  [R0804X4]  (hidden comment: TC124-JR-0722RL)
R55  1k  [R0603]
R56  390  [R0603]
R57  value 1k  [R0603]  (hidden comment: 0)
R58  100  [R0603]
R59  22  [R0603]
R60  22  [R0603]
R61  22  [R0603]
R62  22  [R0603]
R63  22  [R0603]
R64  2k  [R0603]
R65  62  [R0603]
R66  62  [R0603]
R67  2k  [R0603]
SW1  RESET  [TACTM-34N-F]
TP2  TEST-POINT  [PAD]  (value not drawn)
U8  value 1117-3.3  [SOT-223]  (hidden comment: 1117-xxx)
U9  STM32F303CBT6  [STM-LQFP48_N]  (parts A,B of 2)
U10  value SN65HVD232D  [D008_N]  (hidden comment: SN65HVD232)
XT1  value 32.768 KHz  [DT38]  (hidden comment: XTAL)
XT2  value 8 MHz  [HC-49/S-SMD]  (hidden comment: XTAL)

### Ports
ADSP_PWEN, AMP_INT#, AMP_MUTE#, AMP_PWEN, AUX_GPIO0, AUX_GPIO1, AUX_UART_RX, AUX_UART_TX, CAN_RX, CAN_TX, ENC_TUNE_A, ENC_TUNE_B, ENC_VOL_A, ENC_VOL_B, I2C_SCL, I2C_SDA, I2S_REF_BCLK, I2S_REF_LRCK, KEY1, KEY2, MCU_RESET#, RADIO_INT#, RADIO_PWEN, RADIO_RST#, REF_12288MHZ, REF_CLK_EN, SPI_SOC_CLK, SPI_SOC_CS#, SPI_SOC_INT#, SPI_SOC_RX, SPI_SOC_TX

### Nets
3V3: C94.2 C95.1 C96.1 C98.1 CN3.1 CN4.1 D1.1(A) L19.2 L20.2 R64.2 R67.2 U8.2(OUT) U9.24(VDD_2) U9.36(VDD_3) U9.48(VDD_1)
5V0: L18.1
GND: C93.1 C94.1 C95.2 C96.2 C97.2 C98.2 C99.2 C100.2 C101.2 C102.2 C103.2 C104.2(-) C105.2 C106.2 C107.2 C108.1 CN3.4 CN4.8 CN5.3 D2.3(C) R57.2 SW1.1 U8.1(GND) U9.8(VSSA/VREF-) U9.23(VSS_2) U9.35(VSS_3) U9.47(VSS_1) U10.2(GND)
ADSP_PWEN: U9.38(PA15) ; port ADSP_PWEN
AMP_INT#: R63.1 ; port AMP_INT#
AMP_MUTE#: U9.31(PA10) ; port AMP_MUTE#
AMP_PWEN: U9.26(PB13) ; port AMP_PWEN
AUX_GPIO0: R59.1 ; port AUX_GPIO0
AUX_GPIO1: R60.1 ; port AUX_GPIO1
AUX_UART_RX: R62.1 ; port AUX_UART_RX
AUX_UART_TX: R61.1 ; port AUX_UART_TX
CAN_RX: U9.45(PB8) U10.4(R) ; port CAN_RX
CAN_TX: U9.46(PB9) U10.1(D) ; port CAN_TX
CANH: CN5.1 D2.1(A) R66.1 U10.7(CANH)
CANL: CN5.2 D2.2(B) R65.1 U10.6(CANL)
ENC_TUNE_A: CN4.5 U9.32(PA11) ; port ENC_TUNE_A
ENC_TUNE_B: CN4.6 U9.33(PA12) ; port ENC_TUNE_B
ENC_VOL_A: CN4.2 U9.29(PA8) ; port ENC_VOL_A
ENC_VOL_B: CN4.3 U9.30(PA9) ; port ENC_VOL_B
I2C_SCL: R64.1 U9.42(PB6) ; port I2C_SCL
I2C_SDA: R67.1 U9.43(PB7) ; port I2C_SDA
I2S_REF_BCLK: R52.2 ; port I2S_REF_BCLK
I2S_REF_LRCK: R53.2 ; port I2S_REF_LRCK
KEY1: CN4.4 U9.27(PB14) ; port KEY1
KEY2: CN4.7 U9.28(PB15) ; port KEY2
MCU_RESET#: C105.1 SW1.2 TP2.1 U9.7(NRST) ; port MCU_RESET#
RADIO_INT#: U9.40(PB4) ; port RADIO_INT#
RADIO_PWEN: U9.39(PB3) ; port RADIO_PWEN
RADIO_RST#: U9.41(PB5) ; port RADIO_RST#
REF_12288MHZ: U9.10(PA0) ; port REF_12288MHZ
REF_CLK_EN: U9.13(PA3) ; port REF_CLK_EN
SPI_SOC_CLK: R54.6 ; port SPI_SOC_CLK
SPI_SOC_CS#: R54.8 ; port SPI_SOC_CS#
SPI_SOC_INT#: R58.1 ; port SPI_SOC_INT#
SPI_SOC_RX: R54.4 ; port SPI_SOC_RX
SPI_SOC_TX: R54.2 ; port SPI_SOC_TX
SWCLK: CN3.3 U9.37(PA14)
SWDIO: CN3.2 U9.34(PA13)
NetC93_2: C93.2 L18.2 U8.3(IN)
NetC97_1: C97.1 U9.3(PC14-OSC32_IN(PC14)) XT1.1
NetC99_1: C99.1 U9.4(PC15-OSC32_OUT(PC15)) XT1.2
NetC100_1: C100.1 U9.5(PF0-OSC_IN(PF0)) XT2.1
NetC101_1: C101.1 C103.1 L19.1 U9.9(VDDA/VREF+)
NetC102_1: C102.1 R56.2 XT2.2
NetC104_1: C104.1(+) R55.1 U9.1(VBAT)
NetC106_1: C106.1 C107.1 L20.1 U10.3(VCC)
NetC108_2: C108.2 R65.2 R66.2
NetD1_2: D1.2(K) R55.2
NetR52_1: R52.1 U9.11(PA1)
NetR53_1: R53.1 U9.12(PA2)
NetR54_1: R54.1 U9.17(PA7)
NetR54_3: R54.3 U9.16(PA6)
NetR54_5: R54.5 U9.15(PA5)
NetR54_7: R54.7 U9.14(PA4)
NetR56_1: R56.1 U9.6(PF1-OSC_OUT(PF1))
NetR57_1: R57.1 U9.44(BOOT0)
NetR58_2: R58.2 U9.18(PB0)
NetR59_2: R59.2 U9.19(PB1)
NetR60_2: R60.2 U9.20(PB2)
NetR61_2: R61.2 U9.21(PB10)
NetR62_2: R62.2 U9.22(PB11)
NetR63_2: R63.2 U9.25(PB12)

Not connected (* = marked no-connect by the designer): U9 2(PC13)*

### Notes on the sheet
- TIM2_ETR
- TIM2_CH2
- GPIO_IO
- GPIO_OUT
- TIM15_CH1
- SPI1_NSS
- SPI1_SCK
- SPI1_MISO
- I2C1_SCL
- (near U9) EXTI
- TIM1_CH1
- TIM1_CH2
- SPI1_MOSI
- (near U9) I2C1_SDA
- CAN_RX
- CAN_TX
- USART3_TX
- TIM4_CH1
- TIM4_CH2
- SWD_IO
- SWD_CLK
- ADC4_IN4
- ADC4_IN5
- USART3_RX

### Library data of the parts
C93-C103 C105-C108 = CAP_NPOL
CN3 = HDR 4: Header, 4-Pin; LatestRevisionDate: 17-Jul-2002; LatestRevisionNote: Re-released for DXP Platform.; Publisher: Altium Limited
CN4 = HDR 8: Header, 8-Pin; LatestRevisionDate: 17-Jul-2002; LatestRevisionNote: Re-released for DXP Platform.; Publisher: Altium Limited
CN5 = DGxxx-3: PCB terminal block; Value: *
D2 = TVS_BIDIR_DUAL: TVS Diodes
L18-L20 = IND_WO_IRON
R52 R53 R55-R67 = RESISTOR: RES
  R52 R53 R59-R63: Value: 22
  R55: Value: 1k
  R56: Value: 390
  R58: Value: 100
  R64 R67: Value: 2k
  R65 R66: Value: 62
R54 = ARRAY
SW1 = SW tact 2-pin: Microswitches, DTSMB-3 series; Value: SW tact 2-pin
TP2 = TEST-POINT: PCB terminal block; Value: *
U8 = LM1117
U9 = STM32F303CBT6: ARM Cortex-M4 32-bit MCU, 128 KB Flash, 32 KB Internal RAM, 37 I/Os, 48-pin LQFP, -40 to 85 degC, Tray; D/A Converter: 2x12-bit (2 Channel); FLASH Size (Prog) (kB): 128; I/Os (High Current): 37; Internal RAM Size (kB): 32; Operating Frequency(F) (Processor speed) (MHz): 72; Supply Voltage(Vcc) min (V): 2; DatasheetVersion: Rev. 6; PackageVersion: Rev. 6, 06/2013; PackageReference: LQFP48; PackageDescription: 48-Pin Low Profile Quad Flat Package, 7 x 7 mm Body, 0.5 mm Pitch; Supplier 1: Digi-Key; Supplier Part Number 1: STM32F303CBT6-ND; Supplier 2: Newark; Supplier Part Number 2: 99W9871; Supplier 3: Newark; Supplier Part Number 3: 66W7285; Core: ARM Cortex-M4; Packing: Tray; Mounting Technology: Surface Mount; PartNumber: STM32F303CBT6; ComponentLink1Description: Manufacturer URL; ComponentLink1URL: http://www.st.com/web/en/home.html; ComponentLink2Description: Datasheet; ComponentLink2URL: http://www.st.com/st-web-ui/static/active/en/resource/technical/document/datasheet/DM00058181.pdf; ComponentLink3Description: Package Specification; ComponentLink3URL: http://www.st.com/st-web-ui/static/active/en/resource/technical/document/datasheet/DM00058181.pdf

## Nets that join several sheets
3V3: audio_in (L17.2), audio_dsp (L12.1 L13.2), audio_amp_hf (L11.2), audio_amp (7 pins), mcu (15 pins)
5V0: audio_in (CN2.5 CN2.6 CN2.7 L15.2), audio_dsp (P2.2 P3.23 P3.24), mcu (L18.1)
GND: audio_in (14 pins), audio_dsp (36 pins), audio_amp_hf (11 pins), audio_amp (57 pins), mcu (28 pins)
ADSP_PWEN: audio_dsp (R33.1 U4.64), mcu (U9.38)
ADSP_PWMA_7: audio_dsp (U4.32), audio_amp_hf (C47.2)
ADSP_PWMA_8: audio_dsp (U4.30), audio_amp_hf (C48.2)
ADSP_PWMB_7: audio_dsp (U4.31), audio_amp_hf (C46.2)
ADSP_PWMB_8: audio_dsp (U4.29), audio_amp_hf (C49.2)
AMP_I2S_BCLK: audio_dsp (R35.2), audio_amp (U2.13)
AMP_I2S_LRCK: audio_dsp (U4.56), audio_amp (U2.14)
AMP_I2S_SDI_12: audio_dsp (R36.2), audio_amp (U2.15)
AMP_I2S_SDI_34: audio_dsp (R37.2), audio_amp (U2.16)
AMP_INT#: audio_amp (U1.4), mcu (R63.1)
AMP_MUTE#: audio_amp_hf (R22.1), audio_amp (U2.25), mcu (U9.31)
AMP_PWEN: audio_amp (R4.1), mcu (U9.26)
AMP_STBY#: audio_dsp (R39.2), audio_amp (U2.24)
AUX_GPIO0: audio_in (CN2.9), mcu (R59.1)
AUX_GPIO1: audio_in (CN2.10), mcu (R60.1)
AUX_UART_RX: audio_in (CN2.12), mcu (R62.1)
AUX_UART_TX: audio_in (CN2.11), mcu (R61.1)
I2C_SCL: audio_in (CN2.13), audio_dsp (P2.9 U4.19), audio_amp (U2.20), mcu (R64.1 U9.42)
I2C_SDA: audio_in (CN2.14), audio_dsp (P2.8 U4.18), audio_amp (U2.21), mcu (R67.1 U9.43)
I2S_AUX_SDO: audio_in (R51.2), audio_dsp (R31.1)
I2S_REF_BCLK: audio_in (U6.8 U7.8), audio_dsp (P2.6 P3.2 R30.1), mcu (R52.2)
I2S_REF_LRCK: audio_in (U6.7 U7.7), audio_dsp (P2.5 P3.5 P3.6 U4.10), mcu (R53.2)
I2S_SOC_SDI0: audio_in (R50.2), audio_dsp (P3.8)
MCU_RESET#: audio_dsp (U4.15), mcu (C105.1 SW1.2 TP2.1 U9.7)
RADIO_INT#: audio_dsp (P2.10), mcu (U9.40)
RADIO_PWEN: audio_dsp (P2.1), mcu (U9.39)
RADIO_RST#: audio_dsp (P2.11), mcu (U9.41)
REF_12288MHZ: audio_in (U6.6 U7.6), audio_dsp (R27.1 U4.20), audio_amp (U2.12), mcu (U9.10)
REF_CLK_EN: audio_dsp (R26.1 XO1.1), mcu (U9.13)
SPI_SOC_CLK: audio_dsp (P3.14), mcu (R54.6)
SPI_SOC_CS#: audio_dsp (P3.15), mcu (R54.8)
SPI_SOC_INT#: audio_dsp (P3.17), mcu (R58.1)
SPI_SOC_RX: audio_dsp (P3.13), mcu (R54.4)
SPI_SOC_TX: audio_dsp (P3.16), mcu (R54.2)